# EAGLE design xy_plotter_circuit (EAGLE 9.6.2)
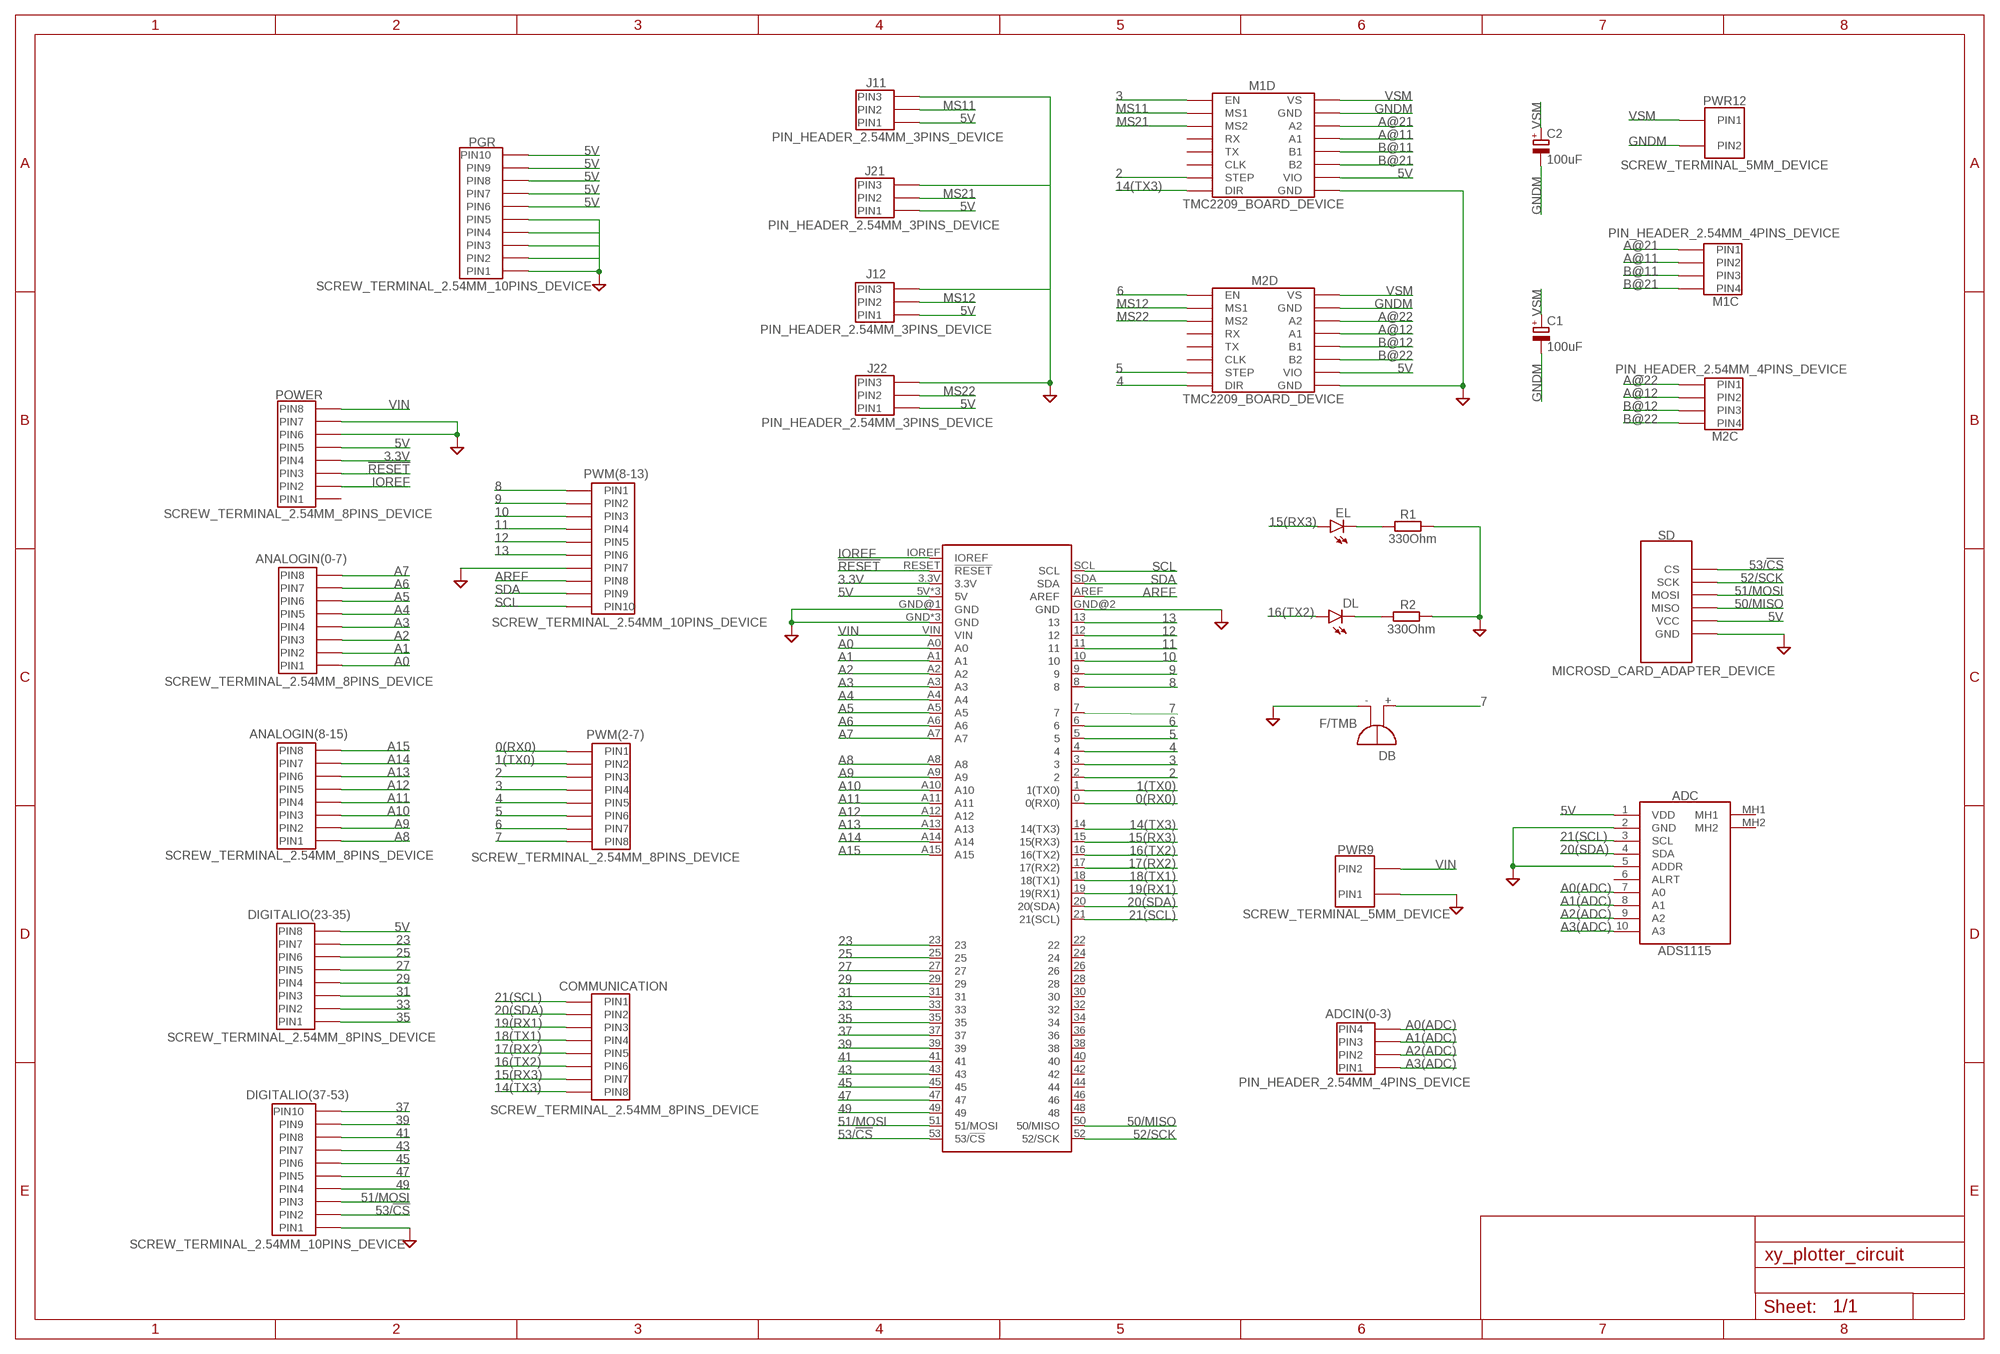
[diagram p0: schematic, sheet 1]

## Parts
ADC  ADS1115  [ADS1115]
ADCIN(0-3)  PIN_HEADER_2.54MM_4PINS_DEVICE  [PIN_HEADER_2.54MM_4PINS_FOOTPRINT]
ANALOGIN(0-7)  SCREW_TERMINAL_2.54MM_8PINS_DEVICE  [SCREW_TERMINAL_2.54MM_8PINS_FOOTPRINT]
ANALOGIN(8-15)  SCREW_TERMINAL_2.54MM_8PINS_DEVICE  [SCREW_TERMINAL_2.54MM_8PINS_FOOTPRINT]
ARDUINO  ARDUINO_MEGA_R3FULL  [ARDUINO_MEGA_NO_SILK]
C1  100uF  CPOL-EUE2.5-7  [E2,5-7]
C2  100uF  CPOL-EUE2.5-7  [E2,5-7]
COMMUNICATION  SCREW_TERMINAL_2.54MM_8PINS_DEVICE  [SCREW_TERMINAL_2.54MM_8PINS_FOOTPRINT]
DB  F/TMB  [F/TMB]
DIGITALIO(23-35)  SCREW_TERMINAL_2.54MM_8PINS_DEVICE  [SCREW_TERMINAL_2.54MM_8PINS_FOOTPRINT]
DIGITALIO(37-53)  SCREW_TERMINAL_2.54MM_10PINS_DEVICE  [SCREW_TERMINAL_2.54MM_10PINS_FOOTPRINT]
DL  LED3MM  [LED3MM]
EL  LED3MM  [LED3MM]
J11  PIN_HEADER_2.54MM_3PINS_DEVICE  [PIN_HEADER_2.54MM_3PINS_FOOTPRINT]
J12  PIN_HEADER_2.54MM_3PINS_DEVICE  [PIN_HEADER_2.54MM_3PINS_FOOTPRINT]
J21  PIN_HEADER_2.54MM_3PINS_DEVICE  [PIN_HEADER_2.54MM_3PINS_FOOTPRINT]
J22  PIN_HEADER_2.54MM_3PINS_DEVICE  [PIN_HEADER_2.54MM_3PINS_FOOTPRINT]
M1C  PIN_HEADER_2.54MM_4PINS_DEVICE  [PIN_HEADER_2.54MM_4PINS_FOOTPRINT]
M1D  TMC2209_BOARD_DEVICE  [TMC2209_BOARD_FOOTPRINT]
M2C  PIN_HEADER_2.54MM_4PINS_DEVICE  [PIN_HEADER_2.54MM_4PINS_FOOTPRINT]
M2D  TMC2209_BOARD_DEVICE  [TMC2209_BOARD_FOOTPRINT]
PGR  SCREW_TERMINAL_2.54MM_10PINS_DEVICE  [SCREW_TERMINAL_2.54MM_10PINS_FOOTPRINT]
POWER  SCREW_TERMINAL_2.54MM_8PINS_DEVICE  [SCREW_TERMINAL_2.54MM_8PINS_FOOTPRINT]
PWM(2-7)  SCREW_TERMINAL_2.54MM_8PINS_DEVICE  [SCREW_TERMINAL_2.54MM_8PINS_FOOTPRINT]
PWM(8-13)  SCREW_TERMINAL_2.54MM_10PINS_DEVICE  [SCREW_TERMINAL_2.54MM_10PINS_FOOTPRINT]
PWR9  SCREW_TERMINAL_5MM_DEVICE  [SCREW_TERMINAL_5MM_FOOTPRINT]
PWR12  SCREW_TERMINAL_5MM_DEVICE  [SCREW_TERMINAL_5MM_FOOTPRINT]
R1  330Ohm  R-EU_0207/7  [0207/7]
R2  330Ohm  R-EU_0207/7  [0207/7]
SD  MICROSD_CARD_ADAPTER_DEVICE  [MICROSD_CARD_ADAPTER_FOOTPRINT]

## Nets
0(RX0): ARDUINO.0(0(RX0)) PWM(2-7).PIN1
1(TX0): ARDUINO.1(1(TX0)) PWM(2-7).PIN2
2: ARDUINO.2 M1D.STEP PWM(2-7).PIN3
3: ARDUINO.3 M1D.EN PWM(2-7).PIN4
3.3V: ARDUINO.3.3V POWER.PIN4
4: ARDUINO.4 M2D.DIR PWM(2-7).PIN5
5: ARDUINO.5 M2D.STEP PWM(2-7).PIN6
5V: ADC.1(VDD) ARDUINO.5V ARDUINO.5V@1(5V) ARDUINO.5V@2(5V) DIGITALIO(23-35).PIN8 J11.PIN1 J12.PIN1 J21.PIN1 J22.PIN1 M1D.VIO M2D.VIO PGR.PIN6 PGR.PIN7 PGR.PIN8 PGR.PIN9 PGR.PIN10 POWER.PIN5 SD.VCC
6: ARDUINO.6 M2D.EN PWM(2-7).PIN7
7: ARDUINO.7 DB.+ PWM(2-7).PIN8
8: ARDUINO.8 PWM(8-13).PIN1
9: ARDUINO.9 PWM(8-13).PIN2
10: ARDUINO.10 PWM(8-13).PIN3
11: ARDUINO.11 PWM(8-13).PIN4
12: ARDUINO.12 PWM(8-13).PIN5
13: ARDUINO.13 PWM(8-13).PIN6
14(TX3): ARDUINO.14(14(TX3)) COMMUNICATION.PIN8 M1D.DIR
15(RX3): ARDUINO.15(15(RX3)) COMMUNICATION.PIN7 EL.A
16(TX2): ARDUINO.16(16(TX2)) COMMUNICATION.PIN6 DL.A
17(RX2): ARDUINO.17(17(RX2)) COMMUNICATION.PIN5
18(TX1): ARDUINO.18(18(TX1)) COMMUNICATION.PIN4
19(RX1): ARDUINO.19(19(RX1)) COMMUNICATION.PIN3
20(SDA): ADC.4(SDA) ARDUINO.20(20(SDA)) COMMUNICATION.PIN2
21(SCL): ADC.3(SCL) ARDUINO.21(21(SCL)) COMMUNICATION.PIN1
23: ARDUINO.23 DIGITALIO(23-35).PIN7
25: ARDUINO.25 DIGITALIO(23-35).PIN6
27: ARDUINO.27 DIGITALIO(23-35).PIN5
29: ARDUINO.29 DIGITALIO(23-35).PIN4
31: ARDUINO.31 DIGITALIO(23-35).PIN3
33: ARDUINO.33 DIGITALIO(23-35).PIN2
35: ARDUINO.35 DIGITALIO(23-35).PIN1
37: ARDUINO.37 DIGITALIO(37-53).PIN10
39: ARDUINO.39 DIGITALIO(37-53).PIN9
41: ARDUINO.41 DIGITALIO(37-53).PIN8
43: ARDUINO.43 DIGITALIO(37-53).PIN7
45: ARDUINO.45 DIGITALIO(37-53).PIN6
47: ARDUINO.47 DIGITALIO(37-53).PIN5
49: ARDUINO.49 DIGITALIO(37-53).PIN4
50/MISO: ARDUINO.50(50/MISO) SD.MISO
51/MOSI: ARDUINO.51(51/MOSI) DIGITALIO(37-53).PIN3 SD.MOSI
52/SCK: ARDUINO.52(52/SCK) SD.SCK
53/!CS: ARDUINO.53(53/!CS) DIGITALIO(37-53).PIN2 SD.CS
!RESET: ARDUINO.RESET(!RESET) POWER.PIN3
A0: ANALOGIN(0-7).PIN1 ARDUINO.A0
A0(ADC): ADC.7(A0) ADCIN(0-3).PIN4
A1: ANALOGIN(0-7).PIN2 ARDUINO.A1
A1(ADC): ADC.8(A1) ADCIN(0-3).PIN3
A2: ANALOGIN(0-7).PIN3 ARDUINO.A2
A2(ADC): ADC.9(A2) ADCIN(0-3).PIN2
A3: ANALOGIN(0-7).PIN4 ARDUINO.A3
A3(ADC): ADC.10(A3) ADCIN(0-3).PIN1
A4: ANALOGIN(0-7).PIN5 ARDUINO.A4
A5: ANALOGIN(0-7).PIN6 ARDUINO.A5
A6: ANALOGIN(0-7).PIN7 ARDUINO.A6
A7: ANALOGIN(0-7).PIN8 ARDUINO.A7
A8: ANALOGIN(8-15).PIN1 ARDUINO.A8
A9: ANALOGIN(8-15).PIN2 ARDUINO.A9
A10: ANALOGIN(8-15).PIN3 ARDUINO.A10
A11: ANALOGIN(8-15).PIN4 ARDUINO.A11
A12: ANALOGIN(8-15).PIN5 ARDUINO.A12
A13: ANALOGIN(8-15).PIN6 ARDUINO.A13
A14: ANALOGIN(8-15).PIN7 ARDUINO.A14
A15: ANALOGIN(8-15).PIN8 ARDUINO.A15
A@11: M1C.PIN2 M1D.A1
A@12: M2C.PIN2 M2D.A1
A@21: M1C.PIN1 M1D.A2
A@22: M2C.PIN1 M2D.A2
AREF: ARDUINO.AREF PWM(8-13).PIN8
B@11: M1C.PIN3 M1D.B1
B@12: M2C.PIN3 M2D.B1
B@21: M1C.PIN4 M1D.B2
B@22: M2C.PIN4 M2D.B2
GND: ADC.2(GND) ADC.5(ADDR) ARDUINO.GND ARDUINO.GND@1(GND) ARDUINO.GND@2(GND) ARDUINO.GND@3(GND) ARDUINO.GND@4(GND) DB.- DIGITALIO(37-53).PIN1 J11.PIN3 J12.PIN3 J21.PIN3 J22.PIN3 M1D.GND@2(GND) M2D.GND@2(GND) PGR.PIN1 PGR.PIN2 PGR.PIN3 PGR.PIN4 PGR.PIN5 POWER.PIN6 POWER.PIN7 PWM(8-13).PIN7 PWR9.PIN1 R1.2 R2.2 SD.GND
GNDM: C1.- C2.- M1D.GND@1(GND) M2D.GND@1(GND) PWR12.PIN2
IOREF: ARDUINO.IOREF POWER.PIN2
MS11: J11.PIN2 M1D.MS1
MS12: J12.PIN2 M2D.MS1
MS21: J21.PIN2 M1D.MS2
MS22: J22.PIN2 M2D.MS2
N$1: EL.K(C) R1.1
N$2: DL.K(C) R2.1
SCL: ARDUINO.SCL PWM(8-13).PIN10
SDA: ARDUINO.SDA PWM(8-13).PIN9
VIN: ARDUINO.VIN POWER.PIN8 PWR9.PIN2
VSM: C1.+ C2.+ M1D.VS M2D.VS PWR12.PIN1
Unconnected: ADC.6(ALRT) ADC.MH1 ADC.MH2 ARDUINO.22 ARDUINO.24 ARDUINO.26 ARDUINO.28 ARDUINO.30 ARDUINO.32 ARDUINO.34 ARDUINO.36 ARDUINO.38 ARDUINO.40 ARDUINO.42 ARDUINO.44 ARDUINO.46 ARDUINO.48 M1D.CLK M1D.RX M1D.TX M2D.CLK M2D.RX M2D.TX POWER.PIN1

## Library data of the parts
ADC = ADS1115:ADS1115: ADAFRUIT INDUSTRIES - ADS1115 - 16 BID ADC- 4 CHANNEL PROGRAMMABLE Source: Datasheet <https://cdn-learn.adafruit.com/downloads/pdf/adafruit-4-channel-adc-breakouts.pdf>; DESCRIPTION: ADAFRUIT INDUSTRIES - ADS1115 - 16 BID ADC- 4 CHANNEL PROGRAMMABLE; HEIGHT: 3.25mm; MANUFACTURER_NAME: Adafruit; MANUFACTURER_PART_NUMBER: ADS1115
ADCIN(0-3) M1C M2C = pin_header_2.54mm_4pins:PIN_HEADER_2.54MM_4PINS_DEVICE
ANALOGIN(0-7) ANALOGIN(8-15) COMMUNICATION DIGITALIO(23-35) POWER PWM(2-7) = screw_terminal_2.54mm_8pins:SCREW_TERMINAL_2.54MM_8PINS_DEVICE
ARDUINO = SparkFun-Boards:ARDUINO_MEGA_R3: Arduino Mega R3 ATmega2560 R3 compatible footprint. SparkFun Products: Arduino Mega 2560 R3 <https://www.sparkfun.com/products/11061>
C1 C2 = rcl:CPOL-EU: POLARIZED CAPACITOR, European symbol; SPICEPREFIX: C
DB = buzzer:F/TMB: BUZZER Source: Buerklin; OC_FARNELL: unknown; OC_NEWARK: unknown
DIGITALIO(37-53) PGR PWM(8-13) = screw_terminal_2.54mm_10pins:SCREW_TERMINAL_2.54MM_10PINS_DEVICE
DL EL = led:LED: LED OSRAM: - CHIPLED LG R971, LG N971, LY N971, LG Q971, LY Q971, LO R971, LY R971 LH N974, LH R974 LS Q976, LO Q976, LY Q976 LO Q996 - Hyper CHIPLED LW Q18S LB Q993, LB Q99A, LB R99A - SideLED LS A670, LO A670, LY A670, LG A670, LP A670 LB A673, LV A673, LT A673, LW A673 LH A674 LY A675 LS A676, LA A676, LO A676, LY A676, LW A676 LS A679, LY A679, LG A679 - Hyper Micro SIDELED® LS Y876, LA Y876, LO Y876, LY Y876 LT Y87S - SmartLED LW L88C, LW L88S LB L89C, LB L89S, LG L890 LS L89K, LO L89K, LY L89K LS L896, LA L896, LO L896, LY L896 - TOPLED LS T670, LO T670, LY T670, LG T670, LP T670 LSG T670, LSP T670, LSY T670, LOP T670, LYG T670 LG T671, LOG T671, LSG T671 LB T673, LV T673, LT T673, LW T673 LH T674 LS T676, LA T676, LO T676, LY T676, LB T676, LH T676, LSB T676, LW T676 LB T67C, LV T67C, LT T67C, LS T67K, LO T67K, LY T67K, LW E67C LS E67B, LA E67B, LO E67B, LY E67B, LB E67C, LV E67C, LT E67C LW T67C LS T679, LY T679, LG T679 LS T770, LO T770, LY T770, LG T770, LP T770 LB T773, LV T773, LT T773, LW T773 LH T774 LS E675, LA E675, LY E675, LS T675 LS T776, LA T776, LO T776, LY T776, LB T776 LHGB T686 LT T68C, LB T68C - Hyper Mini TOPLED® LB M676 - Mini TOPLED Santana® LG M470 LS M47K, LO M47K, LY M47K Source: http://www.osram.convergy.de LUXEON: - LUMILED® LXK2-PW12-R00, LXK2-PW12-S00, LXK2-PW14-U00, LXK2-PW14-V00 LXK2-PM12-R00, LXK2-PM12-S00, LXK2-PM14-U00 LXK2-PE12-Q00, LXK2-PE12-R00, LXK2-PE12-S00, LXK2-PE14-T00, LXK2-PE14-U00 LXK2-PB12-K00, LXK2-PB12-L00, LXK2-PB12-M00, LXK2-PB14-N00, LXK2-PB14-P00, LXK2-PB14-Q00 LXK2-PR12-L00, LXK2-PR12-M00, LXK2-PR14-Q00, LXK2-PR14-R00 LXK2-PD12-Q00, LXK2-PD12-R00, LXK2-PD12-S00 LXK2-PH12-R00, LXK2-PH12-S00 LXK2-PL12-P00, LXK2-PL12-Q00, LXK2-PL12-R00 Source: www.luxeon.com KINGBRIGHT: KA-3528ASYC Source: www.kingbright.com
J11 J12 J21 J22 = pin_header_2.54mm_3pins:PIN_HEADER_2.54MM_3PINS_DEVICE
M1D M2D = TMC2209_V1.3_board:TMC2209_BOARD_DEVICE
PWR9 PWR12 = screw_terminal_5mm:SCREW_TERMINAL_5MM_DEVICE
R1 R2 = rcl:R-EU_: RESISTOR, European symbol; SPICEPREFIX: R
SD = SD_card_board:MICROSD_CARD_ADAPTER_DEVICE

## Board
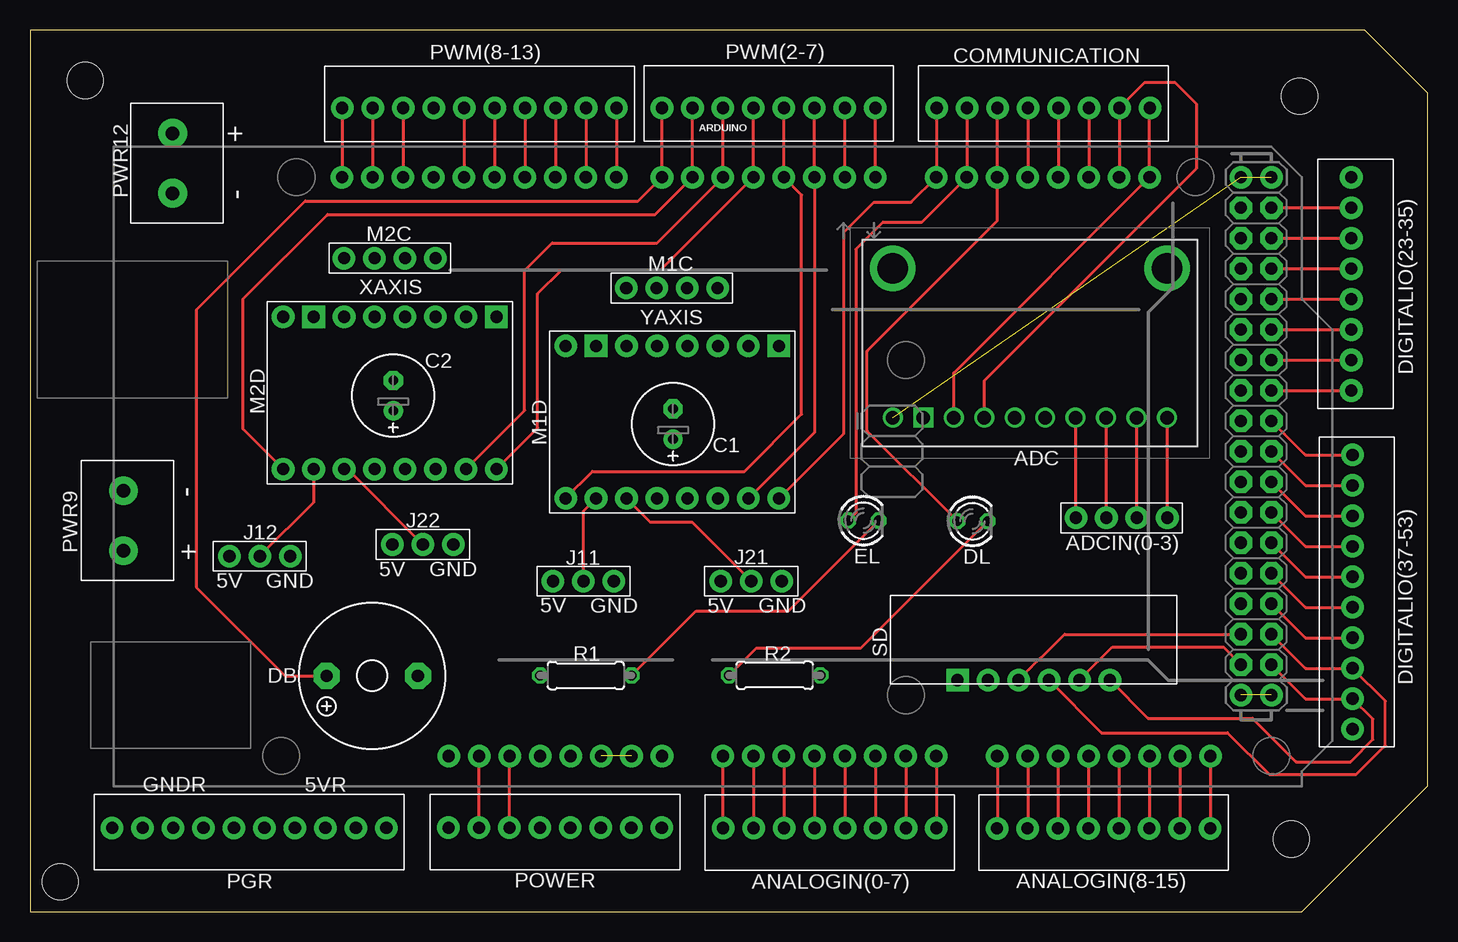
[diagram p1: board, top side]
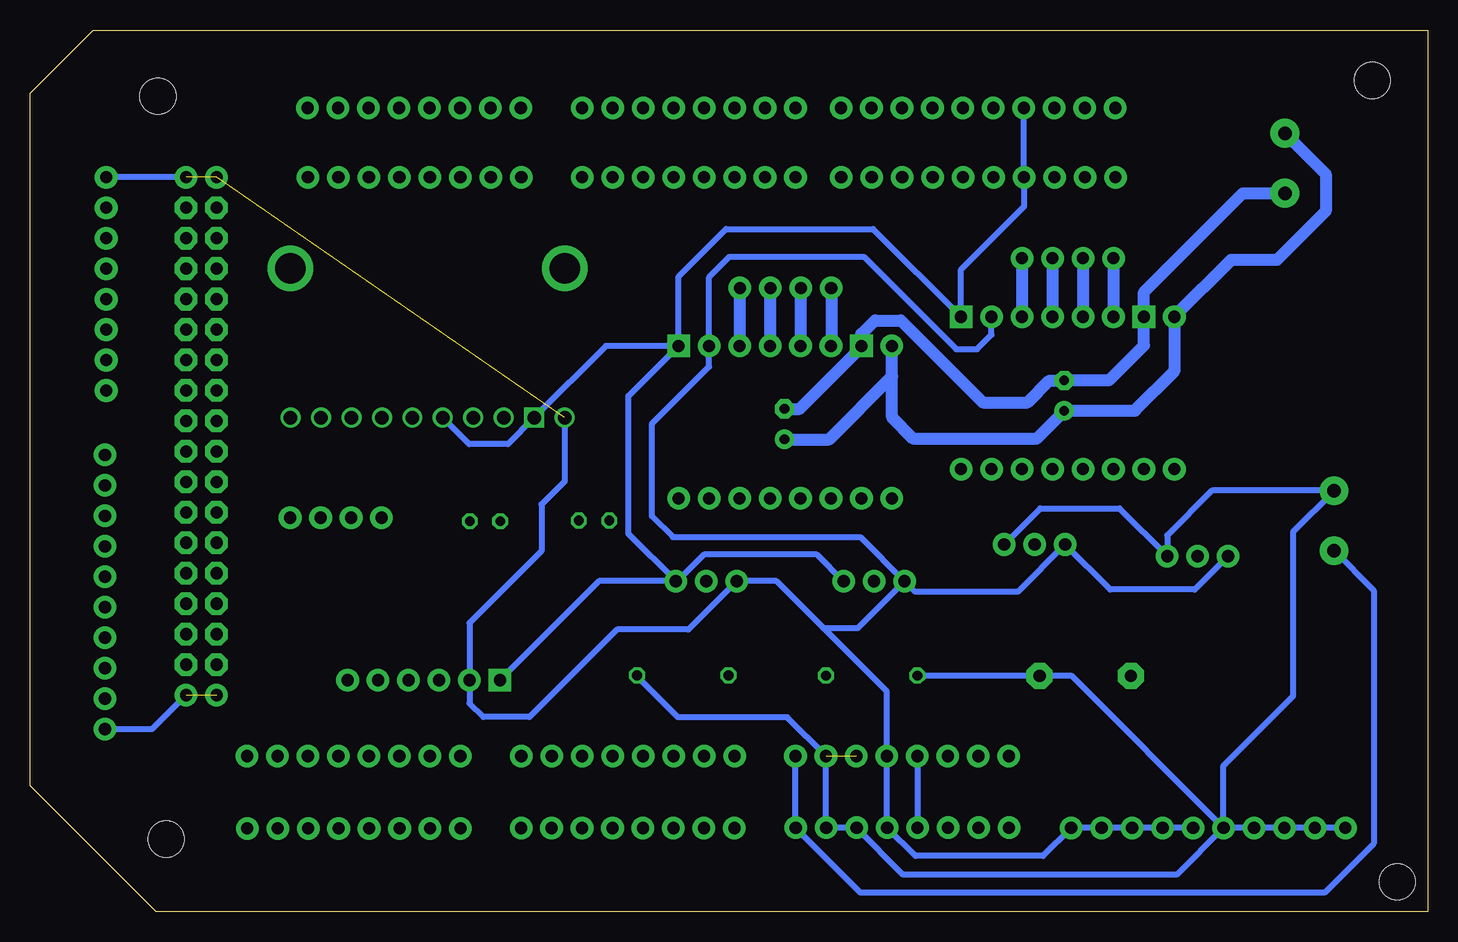
[diagram p2: board, bottom side, seen from below]

Size 116.5 x 73.5 mm. Coordinates in mm from the lower left corner, seen from the top.
Outline: 0,0 106,0 116.5,10.5 116.5,68.25 111.25,73.5 0,73.5 0,0
Copper layers (1*16): Top 0.035mm / dielectric 1.5mm / Bottom 0.035mm
Design rules "default *": minimum track width 6mil, minimum drill 0.35mm, track to track 15mil, track to pad 15mil, pad to pad 15mil, via to via 15mil, smd to smd 15mil, copper to edge 40mil, drill to drill 6mil, minimum pad ring 10mil, minimum via ring 8mil, stop-mask expansion 4mil, vias tented up to drill 0mil, thermal gap 10mil
Holes 3 mm at 2.52,2.49 4.61,69.28 105.14,6.04 105.83,67.97

### Footprints (pad centres in the part's own frame; a part is rotated, then mirrored left to right if it is on the bottom)
ADS1115 = drill 1.11 pad 1.665: 1 0,0; 3 5.08,0; 4 7.62,0; 5 10.16,0; 6 12.7,0; 7 15.24,0; 8 17.78,0; 9 20.32,0; 10 22.86,0 | drill 1.11 pad 1.665 square: 2 2.54,0 | drill 2.54 pad 3.81: MH1 0,12.446; MH2 22.86,12.446
PIN_HEADER_2.54MM_4PINS_FOOTPRINT = drill 1.016 pad 1.88: PIN1 1.245,1.25; PIN2 3.785,1.25; PIN3 6.325,1.25; PIN4 8.865,1.25
SCREW_TERMINAL_2.54MM_8PINS_FOOTPRINT = drill 1.016 pad 1.88: PIN1 1.52,3.5; PIN2 4.06,3.5; PIN3 6.6,3.5; PIN4 9.14,3.5; PIN5 11.68,3.5; PIN6 14.22,3.5; PIN7 16.76,3.5; PIN8 19.3,3.5
ARDUINO_MEGA_NO_SILK = drill 1.016 pad 1.88: 0 13.97,24.13; 1 11.43,24.13; 2 8.89,24.13; 3 6.35,24.13; 3.3V -13.97,-24.13; 4 3.81,24.13; 5 1.27,24.13; 5V -11.43,-24.13; 5V@1 44.45,24.13; 5V@2 46.99,24.13; 6 -1.27,24.13; 7 -3.81,24.13; 8 -7.62,24.13; 9 -10.16,24.13; 10 -12.7,24.13; 11 -15.24,24.13; 12 -17.78,24.13; 13 -20.32,24.13; 14 19.05,24.13; 15 21.59,24.13; 16 24.13,24.13; 17 26.67,24.13; 18 29.21,24.13; 19 31.75,24.13; 20 34.29,24.13; 21 36.83,24.13; A0 1.27,-24.13; A1 3.81,-24.13; A2 6.35,-24.13; A3 8.89,-24.13; A4 11.43,-24.13; A5 13.97,-24.13; A6 16.51,-24.13; A7 19.05,-24.13; A8 24.13,-24.13; A9 26.67,-24.13; A10 29.21,-24.13; A11 31.75,-24.13; A12 34.29,-24.13; A13 36.83,-24.13; A14 39.37,-24.13; A15 41.91,-24.13; AREF -25.4,24.13; GND -8.89,-24.13; GND@1 -6.35,-24.13; GND@2 44.45,-19.05; GND@3 46.99,-19.05; GND@4 -22.86,24.13; IOREF -19.05,-24.13; NC -21.59,-24.13; RESET -16.51,-24.13; SCL -30.48,24.13; SDA -27.94,24.13; VIN -3.81,-24.13 | drill 1.016 pad 1.88 octagon: 22 44.45,21.59; 23 46.99,21.59; 24 44.45,19.05; 25 46.99,19.05; 26 44.45,16.51; 27 46.99,16.51; 28 44.45,13.97; 29 46.99,13.97; 30 44.45,11.43; 31 46.99,11.43; 32 44.45,8.89; 33 46.99,8.89; 34 44.45,6.35; 35 46.99,6.35; 36 44.45,3.81; 37 46.99,3.81; 38 44.45,1.27; 39 46.99,1.27; 40 44.45,-1.27; 41 46.99,-1.27; 42 44.45,-3.81; 43 46.99,-3.81; 44 44.45,-6.35; 45 46.99,-6.35; 46 44.45,-8.89; 47 46.99,-8.89; 48 44.45,-11.43; 49 46.99,-11.43; 50 44.45,-13.97; 51 46.99,-13.97; 52 44.45,-16.51; 53 46.99,-16.51
E2,5-7 = drill 0.813 pad 1.6: + -1.27,0 | drill 0.813 pad 1.6 octagon: - 1.27,0
F/TMB = drill 1.016 pad 2.159 octagon: + 3.81,0; - -3.81,0
SCREW_TERMINAL_2.54MM_10PINS_FOOTPRINT = drill 1.016 pad 1.88: PIN1 1.485,3.5; PIN2 4.025,3.5; PIN3 6.565,3.5; PIN4 9.105,3.5; PIN5 11.645,3.5; PIN6 14.185,3.5; PIN7 16.725,3.5; PIN8 19.265,3.5; PIN9 21.805,3.5; PIN10 24.345,3.5
LED3MM = drill 0.813 octagon: A -1.27,0; K 1.27,0
PIN_HEADER_2.54MM_3PINS_FOOTPRINT = drill 1.016 pad 1.88: PIN1 1.34,1.235; PIN2 3.88,1.235; PIN3 6.42,1.235
TMC2209_BOARD_FOOTPRINT = drill 1.016 pad 1.88: A1 13.945,11.495; A2 13.945,14.035; B1 13.945,8.955; B2 13.945,6.415; CLK 1.24,6.415; DIR 1.24,1.335; EN 1.24,19.115; MS1 1.24,16.575; MS2 1.24,14.035; RX 1.24,11.495; STEP 1.24,3.875; TX 1.24,8.955; VIO 13.945,3.875; VS 13.945,19.115 | drill 1.016 pad 1.88 square: GND@1 13.945,16.575; GND@2 13.945,1.335
SCREW_TERMINAL_5MM_FOOTPRINT = drill 1.118 pad 2.388: PIN1 2.5,3.5; PIN2 7.5,3.5
0207/7 = drill 0.813 octagon: 1 -3.81,0; 2 3.81,0
MICROSD_CARD_ADAPTER_FOOTPRINT = drill 1.016 pad 1.88: CS 7.075,18.3; MISO 7.075,10.68; MOSI 7.075,13.22; SCK 7.075,15.76; VCC 7.075,8.14 | drill 1.016 pad 1.88 square: GND 7.075,5.6

### Placement (x,y rotation side)
ADC  71.93,41.17 0 top
ADCIN(0-3)  96.06,34.08 180 top
ANALOGIN(0-7)  56.26,3.45 0 top
ANALOGIN(8-15)  79.09,3.43 0 top
ARDUINO  56.5,37.09 0 top
C1  53.61,40.64 90 top
C2  30.29,43.01 90 top
COMMUNICATION  94.88,70.51 180 top
DB  28.53,19.66 180 top
DIGITALIO(23-35)  113.65,41.92 90 top
DIGITALIO(37-53)  113.75,13.72 90 top
DL  78.57,32.54 0 top
EL  69.48,32.6 0 top
J11  42.25,26.3 0 top
J12  15.28,28.39 0 top
J21  56.24,26.31 0 top
J22  28.87,29.37 0 top
M1C  48.46,50.73 0 top
M1D  63.76,33.21 90 top
M2C  24.94,53.22 0 top
M2D  40.22,35.64 90 top
PGR  5.36,3.47 0 top
POWER  33.37,3.49 0 top
PWM(2-7)  71.99,70.51 180 top
PWM(8-13)  50.38,70.5 180 top
PWR9  4.29,37.59 270 top
PWR12  8.39,67.39 270 top
R1  46.34,19.67 180 top
R2  62.08,19.69 0 top
SD  71.72,26.37 270 top

### Tracks (layer width: path | path; a pad name or v marks a point on that pad's centre or on a via)
0(RX0)
  Top 0.254: ARDUINO.0 PWM(2-7).PIN1
1(TX0)
  Top 0.254: ARDUINO.1 PWM(2-7).PIN2
2
  Top 0.254: M1D.STEP 65.39,39.95 ARDUINO.2 PWM(2-7).PIN3
3
  Top 0.254: M1D.EN 46.88,36.7 59.56,36.7 64.33,41.46 64.33,59.74 ARDUINO.3 PWM(2-7).PIN4
3.3V
  Bottom 0.508: ARDUINO.3.3V 42.53,7.01 POWER.PIN4
4
  Top 0.254: M2D.DIR 42.33,40.33 42.33,51.51 44.34,53.52 52.6,53.52 ARDUINO.4 PWM(2-7).PIN5
5
  Top 0.254: M2D.STEP 41.23,41.77 41.23,53.45 43.53,55.74 52.29,55.74 ARDUINO.5 PWM(2-7).PIN6
5V  (2 unrouted)
  Bottom 0.508: PGR.PIN6 PGR.PIN7 PGR.PIN8 PGR.PIN9 PGR.PIN10 32.05,4.63 42.69,4.63 POWER.PIN5 45.05,12.95 ARDUINO.5V 45.07,18.34 50.37,23.64 | J12.PIN1 19.41,26.84 26.44,26.84 J22.PIN1 34.16,26.65 42.7,26.65 J11.PIN1 | 50.37,23.64 54.28,27.55 J21.PIN1 61.61,23.52 67.56,23.52 74.86,16.22 78.7,16.22 79.86,17.37 SD.VCC 79.86,24.06 73.86,30.06 73.86,33.94 71.92,35.88 ADC.1 | 50.37,23.64 47.49,23.64 J11.PIN1 | M2D.VIO 36.35,48.1 37.55,46.89 39.28,46.89 46.99,54.6 58.18,54.6 59.89,52.89 M1D.VIO 59.89,45.42 64.67,40.64 64.67,32.97 62.92,31.22 47.27,31.22 J11.PIN1 | ARDUINO.5V@2 DIGITALIO(23-35).PIN8
6
  Top 0.254: M2D.EN 17.77,40.22 17.77,51.09 24.8,58.12 52.12,58.12 ARDUINO.6 PWM(2-7).PIN7
7
  Top 0.254: DB.+ 21.25,19.66 13.87,27.04 13.87,50.15 22.95,59.23 50.69,59.23 ARDUINO.7 PWM(2-7).PIN8
8
  Top 0.254: PWM(8-13).PIN1 48.89,61.24 ARDUINO.8
9
  Top 0.254: PWM(8-13).PIN2 46.35,61.24 ARDUINO.9
10
  Top 0.254: PWM(8-13).PIN3 43.81,61.24 ARDUINO.10
11
  Top 0.254: PWM(8-13).PIN4 41.27,61.24 ARDUINO.11
12
  Top 0.254: PWM(8-13).PIN5 38.73,61.24 ARDUINO.12
13
  Top 0.254: PWM(8-13).PIN6 36.19,61.24 ARDUINO.13
14(TX3)
  Top 0.254: M1D.DIR 67.85,39.87 67.85,56.63 70.34,59.13 73.45,59.13 ARDUINO.14 75.58,61.25 COMMUNICATION.PIN8
15(RX3)
  Top 0.254: EL.A 68.85,33.23 68.85,55.21 71.11,57.48 74.36,57.48 78.12,61.23 78.12,61.25 | COMMUNICATION.PIN7 78.12,61.25 | 78.12,61.25 ARDUINO.15
16(TX2)
  Top 0.254: DL.A 69.77,40.07 69.77,46.72 80.62,57.56 ARDUINO.16 80.63,66.98 COMMUNICATION.PIN6
17(RX2)
  Top 0.254: COMMUNICATION.PIN5 83.2,61.25 ARDUINO.17
18(TX1)
  Top 0.254: COMMUNICATION.PIN4 85.74,61.25 ARDUINO.18
19(RX1)
  Top 0.254: COMMUNICATION.PIN3 88.28,61.25 ARDUINO.19
20(SDA)
  Top 0.254: ADC.4 79.55,44.27 97.22,61.94 97.22,67.37 95.49,69.1 92.9,69.1 COMMUNICATION.PIN2 90.82,61.25 ARDUINO.20
21(SCL)
  Top 0.254: ADC.3 77,44.9 ARDUINO.21 93.33,66.98 COMMUNICATION.PIN1
23
  Top 0.254: ARDUINO.23 DIGITALIO(23-35).PIN7
25
  Top 0.254: ARDUINO.25 DIGITALIO(23-35).PIN6
27
  Top 0.254: ARDUINO.27 DIGITALIO(23-35).PIN5
29
  Top 0.254: ARDUINO.29 DIGITALIO(23-35).PIN4
31
  Top 0.254: ARDUINO.31 DIGITALIO(23-35).PIN3
33
  Top 0.254: ARDUINO.33 DIGITALIO(23-35).PIN2
35
  Top 0.254: ARDUINO.35 DIGITALIO(23-35).PIN1
37
  Top 0.254: ARDUINO.37 106.32,38.07 DIGITALIO(37-53).PIN10
39
  Top 0.254: ARDUINO.39 106.32,35.53 DIGITALIO(37-53).PIN9
41
  Top 0.254: ARDUINO.41 106.32,32.99 DIGITALIO(37-53).PIN8
43
  Top 0.254: ARDUINO.43 106.32,30.45 DIGITALIO(37-53).PIN7
45
  Top 0.254: ARDUINO.45 106.32,27.91 DIGITALIO(37-53).PIN6
47
  Top 0.254: ARDUINO.47 106.32,25.37 DIGITALIO(37-53).PIN5
49
  Top 0.254: ARDUINO.49 106.32,22.83 DIGITALIO(37-53).PIN4
50/MISO
  Top 0.254: SD.MISO 86.23,23.12 ARDUINO.50
51/MOSI
  Top 0.254: SD.MOSI 89.33,14.91 99.83,14.91 103.3,11.44 110.57,11.44 112.98,13.85 112.98,17.56 DIGITALIO(37-53).PIN3 106.32,20.29 ARDUINO.51
52/SCK
  Top 0.254: SD.SCK 90.24,22.05 99.48,22.05 ARDUINO.52
53/!CS
  Top 0.254: SD.CS 93.2,16.12 101.91,16.12 105.54,12.49 110.09,12.49 111.94,14.34 111.94,16.06 DIGITALIO(37-53).PIN2 106.32,17.75 ARDUINO.53
!RESET
  Top 0.254: POWER.PIN3 39.97,12.95 ARDUINO.RESET
A0
  Top 0.254: ANALOGIN(0-7).PIN1 ARDUINO.A0
A0(ADC)
  Top 0.254: ADC.7 87.17,32.85 ADCIN(0-3).PIN4
A1
  Top 0.254: ARDUINO.A1 60.31,6.96 ANALOGIN(0-7).PIN2
A1(ADC)
  Top 0.254: ADC.8 89.7,32.85 ADCIN(0-3).PIN3
A2
  Top 0.254: ARDUINO.A2 62.85,6.96 ANALOGIN(0-7).PIN3
A2(ADC)
  Top 0.254: ADC.9 92.25,32.85 ADCIN(0-3).PIN2
A3
  Top 0.254: ARDUINO.A3 65.39,6.96 ANALOGIN(0-7).PIN4
A3(ADC)
  Top 0.254: ADC.10 94.78,32.85 ADCIN(0-3).PIN1
A4
  Top 0.254: ARDUINO.A4 67.93,6.96 ANALOGIN(0-7).PIN5
A5
  Top 0.254: ARDUINO.A5 70.47,6.96 ANALOGIN(0-7).PIN6
A6
  Top 0.254: ARDUINO.A6 73.01,6.96 ANALOGIN(0-7).PIN7
A7
  Top 0.254: ARDUINO.A7 75.55,6.96 ANALOGIN(0-7).PIN8
A8
  Top 0.254: ARDUINO.A8 80.63,6.95 ANALOGIN(8-15).PIN1
A9
  Top 0.254: ARDUINO.A9 83.17,6.95 ANALOGIN(8-15).PIN2
A10
  Top 0.254: ARDUINO.A10 85.71,6.95 ANALOGIN(8-15).PIN3
A11
  Top 0.254: ARDUINO.A11 88.25,6.95 ANALOGIN(8-15).PIN4
A12
  Top 0.254: ARDUINO.A12 90.79,6.95 ANALOGIN(8-15).PIN5
A13
  Top 0.254: ARDUINO.A13 93.33,6.95 ANALOGIN(8-15).PIN6
A14
  Top 0.254: ARDUINO.A14 95.87,6.95 ANALOGIN(8-15).PIN7
A15
  Top 0.254: ARDUINO.A15 98.41,6.95 ANALOGIN(8-15).PIN8
A@11
  Bottom 1.016: M1C.PIN2 52.25,51.97 52.25,47.17 M1D.A1
A@12
  Bottom 1.016: M2C.PIN2 M2D.A1
A@21
  Bottom 1.016: M1C.PIN1 49.7,47.18 M1D.A2
A@22
  Bottom 1.016: M2C.PIN1 M2D.A2
AREF
  Top 0.254: PWM(8-13).PIN8 31.11,61.24 ARDUINO.AREF
B@11
  Bottom 1.016: M1C.PIN3 54.81,51.96 M1D.B1
B@12
  Bottom 1.016: M2C.PIN3 M2D.B1
B@21
  Bottom 1.016: M1C.PIN4 57.35,51.96 M1D.B2
B@22
  Bottom 1.016: M2C.PIN4 M2D.B2
GND  (2 unrouted)
  Bottom 0.508: J22.PIN3 32.28,33.61 25.68,33.61 J12.PIN3 21.7,31.36 17.97,35.09 PWR9.PIN1 7.79,35.08 11.22,31.65 11.22,17.94 17.06,12.1 17.06,7.02 | 17.06,7.02 PGR.PIN5 | PGR.PIN1 PGR.PIN2 PGR.PIN3 PGR.PIN4 PGR.PIN5 | PGR.PIN5 20.9,3.08 43.71,3.08 47.59,6.96 POWER.PIN6 POWER.PIN7 50.15,7.01 ARDUINO.GND@1 53.39,16.2 62.5,16.2 65.89,19.6 R2.2 | 17.06,7.02 29.7,19.67 32.33,19.67 DB.- R1.2 | J11.PIN3 50.9,29.77 60.32,29.77 62.54,27.55 J21.PIN3 | J21.PIN3 69.07,27.55 SD.GND | J21.PIN3 66.61,31.49 66.61,42.99 M1D.GND@2 | M1D.GND@2 62.43,52.95 58.47,56.91 46.21,56.91 M2D.GND@2 38.89,53.52 33.63,58.77 ARDUINO.GND@4 33.64,66.98 PWM(8-13).PIN7 | ARDUINO.GND@3 106.32,15.21 DIGITALIO(37-53).PIN1 | M1D.GND@2 68.48,47.16 ADC.2 76.66,38.98 79.89,38.98 ADC.5
GNDM
  Bottom 1.016: C1.- 52.34,41.91 47.19,47.05 M1D.GND@1 47.19,48.16 46.05,49.29 43.9,49.29 37.07,42.45 33.32,42.45 31.51,44.27 C2.- 30.28,44.27 26.57,44.27 23.64,47.19 M2D.GND@1 23.64,51.63 15.39,59.89 PWR12.PIN2
IOREF
  Top 0.254: POWER.PIN2 37.43,12.95 ARDUINO.IOREF
MS11
  Top 0.254: J11.PIN2 46.13,33.4 M1D.MS1
MS12
  Top 0.254: M2D.MS1 23.64,34.11 J12.PIN2
MS21
  Top 0.254: J21.PIN2 55.22,32.45 51.73,32.45 M1D.MS2
MS22
  Top 0.254: J22.PIN2 26.47,36.88 M2D.MS2
N$1
  Top 0.254: R1.1 55.53,25.06 63.21,25.06 EL.K
N$2
  Top 0.254: R2.1 60.54,21.97 69.26,21.97 DL.K
SCL
  Top 0.254: PWM(8-13).PIN10 26.03,61.24 ARDUINO.SCL
SDA
  Top 0.254: PWM(8-13).PIN9 28.57,61.24 ARDUINO.SDA
VIN
  Bottom 0.508: PWR9.PIN2 4.49,26.79 4.49,5.66 8.57,1.58 47.28,1.58 52.67,6.97 POWER.PIN8 52.67,12.95 ARDUINO.VIN
VSM
  Bottom 1.016: PWR12.PIN1 8.49,61.49 8.49,58.39 12.56,54.32 16.37,54.32 M2D.VS 21.11,45.03 24.39,41.75 30.28,41.75 C2.+ 32.62,39.41 42.84,39.41 44.64,41.21 44.64,44.6 | C1.+ 49.87,39.37 44.64,44.6 | 44.64,44.6 44.64,47.15 M1D.VS

### Text on the board
tNames: + | - | XAXIS | YAXIS | - | + | 5V | GND | 5V | GND | 5V | GND | 5V | GND | GNDR | 5VR